# EAGLE design Arduino5VPowerSupply (EAGLE 7.1.0)
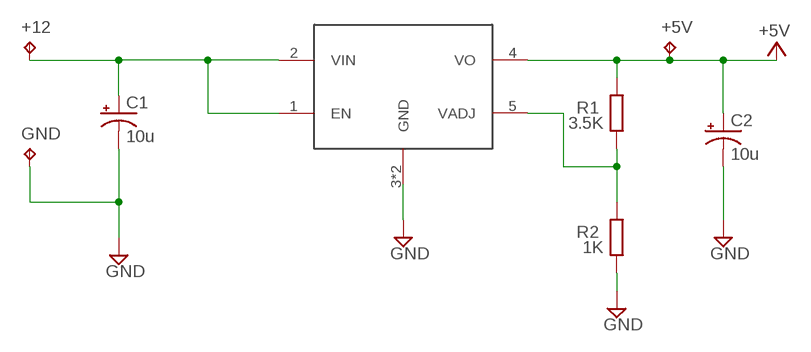
[diagram p0: schematic, sheet 1]

## Parts
+5V  TPPAD1-13  [P1-13]
+12  TPPAD1-13  [P1-13]
C1  10u  CPOL-US153CLV-0405  [153CLV-0405]
C2  10u  CPOL-US153CLV-0405  [153CLV-0405]
GND  TPPAD1-13  [P1-13]
R1  3.5K  R-EU_R0805  [R0805]
R2  1K  R-EU_R0805  [R0805]
U5  TLF1963TBATMA1  TLF1963  [DPAK]

## Nets
+5V: +5V.TP C2.+ R1.2 U5.4(VO)
GND: C1.- C2.- GND.TP R2.1 U5.3(GND) U5.6(GND)
N$13: +12.TP C1.+ U5.1(EN) U5.2(VIN)
N$15: R1.1 R2.2 U5.5(VADJ)

## Library data of the parts
+5V +12 GND = testpad:TP: Test pad
C1 C2 = Dash parts:CPOL-US: POLARIZED CAPACITOR, American symbol; EEE-FPV100UAR: 10u
R1 = SmartPrj:R-EU_: RESISTOR, European symbol; SMD: 3.5K, 1%
R2 = SmartPrj:R-EU_: RESISTOR, European symbol; SMD: 1K, 1%
U5 = Dash parts:TLF1963

## Net classes
0 default: width 0.203 mm, drill 0.406 mm, clearance 0.203 mm

## Board
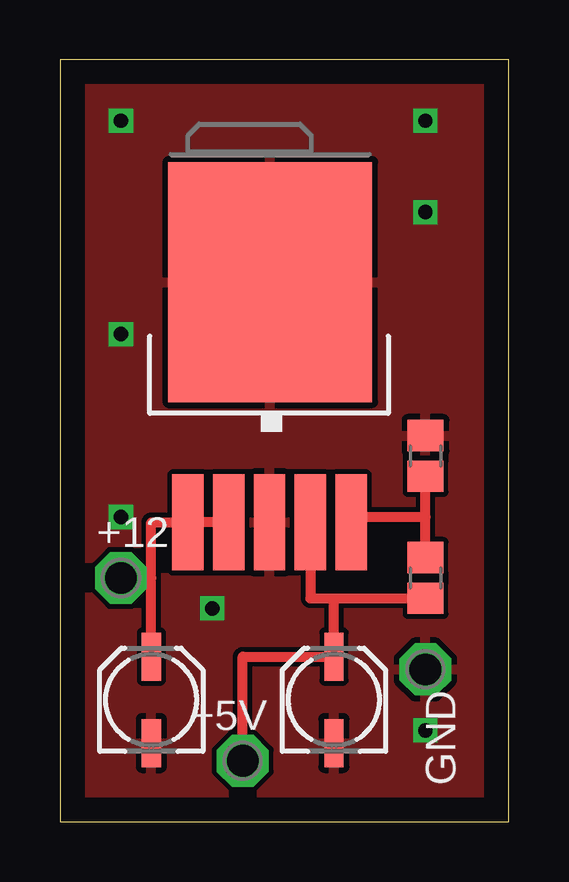
[diagram p1: board, top side]
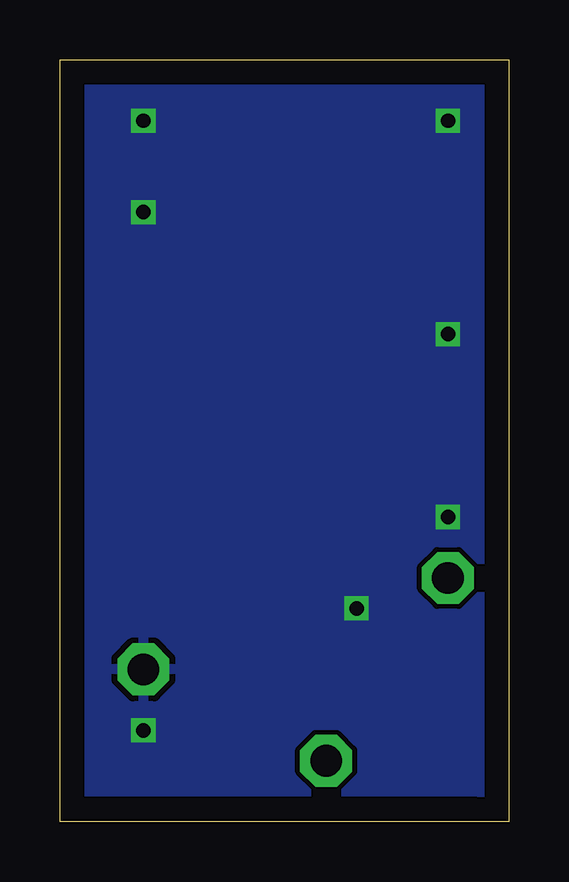
[diagram p2: board, bottom side, seen from below]

Size 18.72 x 31.74 mm. Coordinates in mm from the lower left corner, seen from the top.
Outline: 0,0 18.72,0 18.72,31.74 0,31.74 0,0
Copper layers (1*16): Top 0.035mm / dielectric 1.5mm / Bottom 0.035mm
Design rules "default": minimum track width 10mil, minimum drill 24mil, track to track 8mil, track to pad 8mil, pad to pad 8mil, via to via 8mil, smd to smd 8mil, copper to edge 40mil, drill to drill 8mil, minimum pad ring 10mil, minimum via ring 8mil, stop-mask expansion 4mil, vias tented up to drill 0mil, thermal gap 10mil

### Footprints (pad centres in the part's own frame; a part is rotated, then mirrored left to right if it is on the bottom)
P1-13 = drill 1.321 pad 2.159 octagon: TP 0,0
153CLV-0405 = smd 2 x 0.8: + 1.8,0; - -1.8,0
R0805 = smd 1.3 x 1.5: 1 -0.85,0; 2 0.85,0
DPAK = smd 1.31 x 4: 1 -2.28,-4.04; 2 -0.58,-4.04; 3 1.12,-4.04; 4 2.82,-4.04; 5 4.52,-4.04 | smd 8.5 x 10: 6 1.15,5.97

### Placement (x,y rotation side)
+5V  7.62,2.54 0 top
+12  2.54,10.16 0 top
C1  3.81,5.08 90 top
C2  11.43,5.08 90 top
GND  15.24,6.35 0 top
R1  15.24,10.16 270 top
R2  15.24,15.24 270 top
U5  7.62,16.51 0 top

### Tracks (layer width: path | path; a pad name or v marks a point on that pad's centre or on a via)
+5V
  Top 0.406: +5V.TP 7.62,6.88 C2.+ 11.43,9.31 | 11.43,9.31 R1.2 | U5.4 10.44,9.31 11.43,9.31
GND  (via drill 0.6)
  other vias: 2.54,12.7 15.24,25.4 15.24,3.81 6.35,8.89 2.54,20.32 2.54,29.21 15.24,29.21
  pour Top: 0,0 0,31.75 22.86,31.75 22.86,0
  pour Bottom: 0,0 0,31.75 22.86,31.75 22.86,1.27 1.27,1.27
N$13
  Top 0.406: U5.1 5.08,12.21 | U5.2 U5.1 | C1.+ 3.81,10.16 | 3.81,10.16 +12.TP | 3.81,10.16 3.81,12.47 U5.1
N$15
  Top 0.406: R1.1 15.24,12.7 | 15.24,12.7 R2.2 | U5.5 12.14,12.7 15.24,12.7